# EAGLE schematic workInProgTCIAADC (EAGLE 9.6.2)
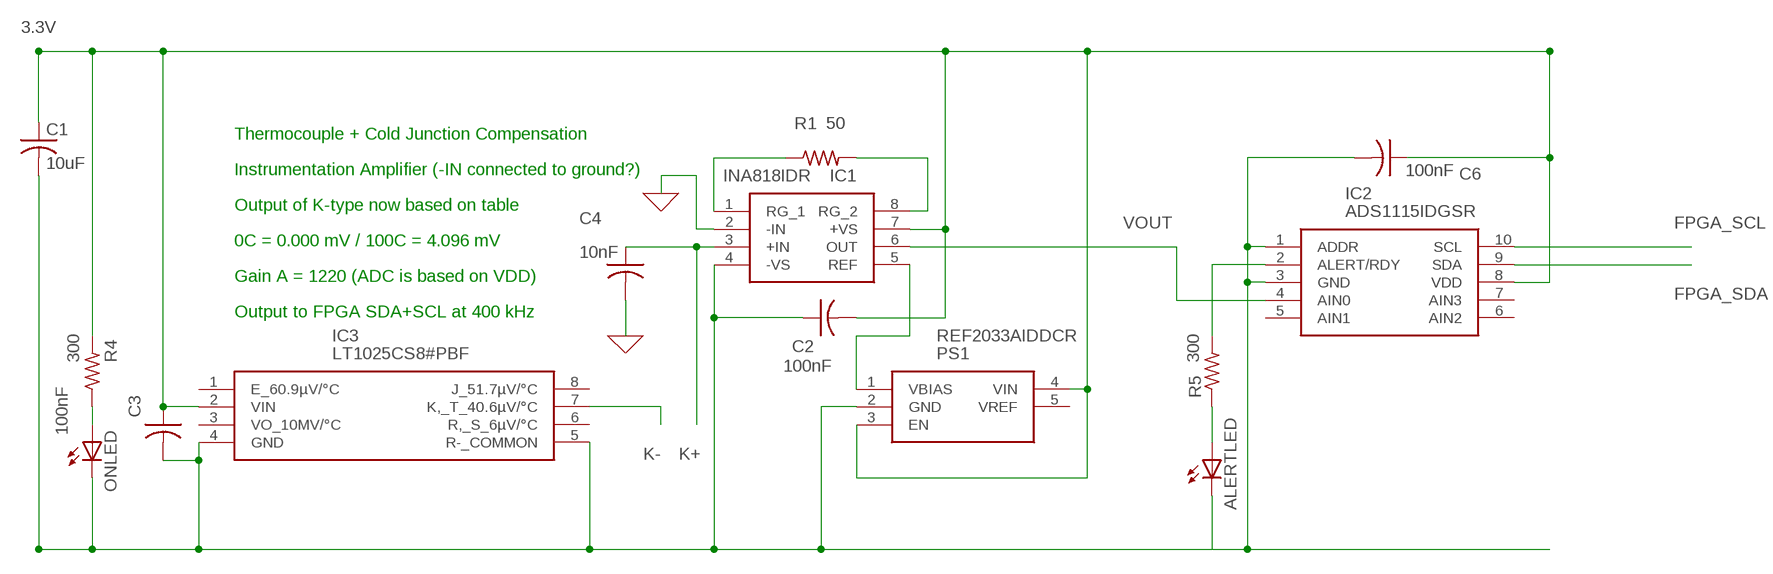
[diagram p0: schematic, sheet 1]

## Parts
ALERTLED  LEDCHIP-LED0805  [CHIP-LED0805]
C1  10uF  C-USC0805  [C0805]
C2  100nF  C-USC0805  [C0805]
C3  100nF  C-USC0805  [C0805]
C4  10nF  C-USC0805  [C0805]
C6  100nF  C-USC0805  [C0805]
IC1  INA818IDR  [SOIC127P600X175-8N]
IC2  ADS1115IDGSR  [SOP50P490X110-10N]
IC3  LT1025CS8#PBF  [SOIC127P599X175-8N]
ONLED  LEDCHIP-LED0805  [CHIP-LED0805]
PS1  REF2033AIDDCR  [SOT95P280X110-5N]
R1  50  R-US_R0805  [R0805]
R4  300  R-US_R0805  [R0805]
R5  300  R-US_R0805  [R0805]

## Nets
0: C4.2 IC1.2(-IN) ; supply symbol labelled GND
3.3V: C1.1 C2.2 C3.1 C6.1 IC1.7(+VS) IC2.8(VDD) IC3.2(VIN) PS1.3(EN) PS1.4(VIN) R4.2
FPGA_SCL: IC2.10(SCL)
FPGA_SDA: IC2.9(SDA)
K+: C4.1 IC1.3(+IN)
K-: IC3.7(K,_T_40.6µV/°C)
N$1: ONLED.A R4.1
N$2: IC1.1(RG_1) R1.1
N$3: IC1.8(RG_2) R1.2
N$4: IC1.5(REF) PS1.1(VBIAS)
N$5: C1.2 C2.1 C3.2 C6.2 IC1.4(-VS) IC2.1(ADDR) IC2.3(GND) IC3.4(GND) IC3.5(R-_COMMON) ONLED.C PS1.2(GND)
N$6: ALERTLED.C
N$9: ALERTLED.A R5.1
N$10: IC2.2(ALERT/RDY) R5.2
VOUT: IC1.6(OUT) IC2.4(AIN0)
Unconnected: IC2.5(AIN1) IC2.6(AIN2) IC2.7(AIN3) IC3.1(E_60.9µV/°C) IC3.3(VO_10MV/°C) IC3.6(R,_S_6µV/°C) IC3.8(J_51.7µV/°C) PS1.5(VREF)

## Notes on the sheet
- Thermocouple + Cold Junction Compensation
- Instrumentation Amplifier (-IN connected to ground?)
- Output of K-type now based on table
- 0C = 0.000 mV / 100C = 4.096 mV
- Gain A = 1220 (ADC is based on VDD)
- Output to FPGA SDA+SCL at 400 kHz

## Library data of the parts
ALERTLED ONLED = adafruit:LED: LED OSRAM: - CHIPLED LG R971, LG N971, LY N971, LG Q971, LY Q971, LO R971, LY R971 LH N974, LH R974 LS Q976, LO Q976, LY Q976 LO Q996 - Hyper CHIPLED LW Q18S LB Q993, LB Q99A, LB R99A - SideLED LS A670, LO A670, LY A670, LG A670, LP A670 LB A673, LV A673, LT A673, LW A673 LH A674 LY A675 LS A676, LA A676, LO A676, LY A676, LW A676 LS A679, LY A679, LG A679 - Hyper Micro SIDELED® LS Y876, LA Y876, LO Y876, LY Y876 LT Y87S - SmartLED LW L88C, LW L88S LB L89C, LB L89S, LG L890 LS L89K, LO L89K, LY L89K LS L896, LA L896, LO L896, LY L896 - TOPLED LS T670, LO T670, LY T670, LG T670, LP T670 LSG T670, LSP T670, LSY T670, LOP T670, LYG T670 LG T671, LOG T671, LSG T671 LB T673, LV T673, LT T673, LW T673 LH T674 LS T676, LA T676, LO T676, LY T676, LB T676, LH T676, LSB T676, LW T676 LB T67C, LV T67C, LT T67C, LS T67K, LO T67K, LY T67K, LW E67C LS E67B, LA E67B, LO E67B, LY E67B, LB E67C, LV E67C, LT E67C LW T67C LS T679, LY T679, LG T679 LS T770, LO T770, LY T770, LG T770, LP T770 LB T773, LV T773, LT T773, LW T773 LH T774 LS E675, LA E675, LY E675, LS T675 LS T776, LA T776, LO T776, LY T776, LB T776 LHGB T686 LT T68C, LB T68C - Hyper Mini TOPLED® LB M676 - Mini TOPLED Santana® LG M470 LS M47K, LO M47K, LY M47K Source: http://www.osram.convergy.de/
C1-C4 C6 = rcl:C-US: CAPACITOR, American symbol; SPICEPREFIX: C
IC1 = INA818IDR:INA818IDR: 35-uV offset, 8-nV/Hz noise, low-power, precision instrumentation amplifier Source: Datasheet <http://www.ti.com/lit/gpn/INA818>; DESCRIPTION: 35-uV offset, 8-nV/Hz noise, low-power, precision instrumentation amplifier; HEIGHT: 1.75mm; MANUFACTURER_NAME: Texas Instruments; MANUFACTURER_PART_NUMBER: INA818IDR; MOUSER_PART_NUMBER: 595-INA818IDR; MOUSER_PRICE-STOCK: https://www.mouser.co.uk/ProductDetail/Texas-Instruments/INA818IDR?qs=T3oQrply3y%252BvW%2FEIvqoymg%3D%3D
IC2 = SamacSys_Parts:ADS1115IDGSR: 16-Bit 860SPS 4-Ch Delta-Sigma ADC With PGA, Oscillator, Vref, Comparator, and I2C Source: Datasheet <http://www.ti.com/lit/gpn/ADS1115>; DESCRIPTION: 16-Bit 860SPS 4-Ch Delta-Sigma ADC With PGA, Oscillator, Vref, Comparator, and I2C; HEIGHT: 1.1mm; MANUFACTURER_NAME: Texas Instruments; MANUFACTURER_PART_NUMBER: ADS1115IDGSR; MOUSER_PART_NUMBER: 595-ADS1115IDGSR; MOUSER_PRICE-STOCK: https://www.mouser.co.uk/ProductDetail/Texas-Instruments/ADS1115IDGSR?qs=IK5e5L0zOXjKCJoVMhYO%2FQ%3D%3D
IC3 = LT1025CS8#PBF:LT1025CS8#PBF: LINEAR TECHNOLOGY - LT1025CS8#PBF - , , +/- 0.5C, 0 C, +70 C, SOIC, 8 Source: Datasheet <https://componentsearchengine.com/Datasheets/2/LT1025CS8#PBF.pdf>; ARROW_PART_NUMBER: LT1025CS8#PBF; ARROW_PRICE-STOCK: https://www.arrow.com/en/products/lt1025cs8pbf/linear-technology; DESCRIPTION: LINEAR TECHNOLOGY - LT1025CS8#PBF - , , +/- 0.5C, 0 C, +70 C, SOIC, 8; HEIGHT: 1.752mm; MANUFACTURER_NAME: Linear Technology; MANUFACTURER_PART_NUMBER: LT1025CS8#PBF; MOUSER_PART_NUMBER: 584-LT1025CS8#PBF; MOUSER_PRICE-STOCK: https://www.mouser.co.uk/ProductDetail/Analog-Devices-Linear-Technology/LT1025CS8PBF?qs=ytflclh7QUVFTkxgoaF%252Bog%3D%3D
PS1 = REF2033AIDDCR:REF2033AIDDCR: Low-Drift, Low-Power, Dual-Output Vref and Vref/2 Voltage Reference Source: Datasheet <http://www.ti.com/lit/ds/symlink/ref2033.pdf>; DESCRIPTION: Low-Drift, Low-Power, Dual-Output Vref and Vref/2 Voltage Reference; HEIGHT: 1.1mm; MANUFACTURER_NAME: Texas Instruments; MANUFACTURER_PART_NUMBER: REF2033AIDDCR; MOUSER_PART_NUMBER: 595-REF2033AIDDCR; MOUSER_PRICE-STOCK: https://www.mouser.co.uk/ProductDetail/Texas-Instruments/REF2033AIDDCR?qs=7z%252BmIopC6%2FKHHOBVNaL7UQ%3D%3D
R1 R4 R5 = adafruit:R-US_: RESISTOR, American symbol